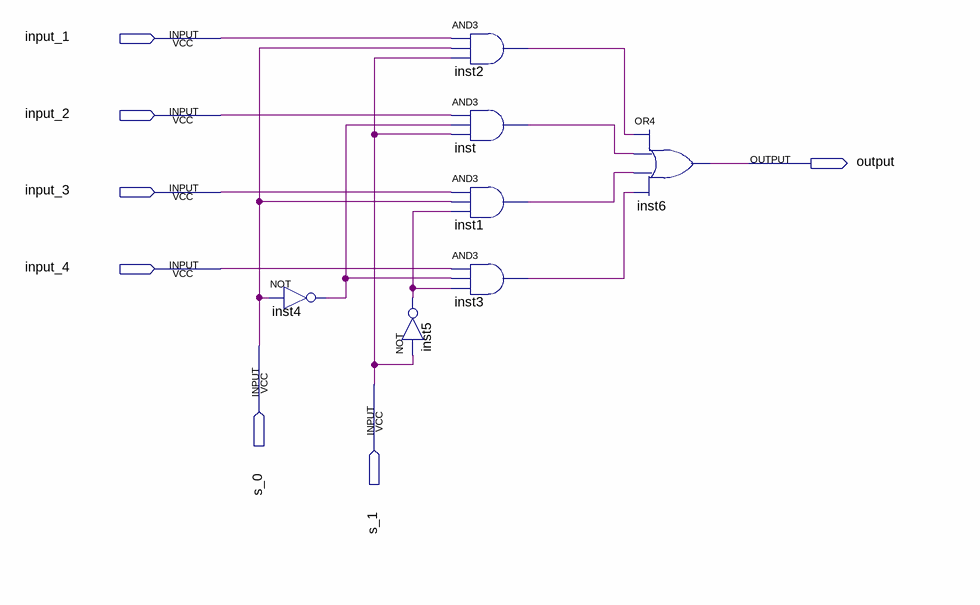
[diagram p0: schematic sheet]
// Quartus schematic Multiplexer.bdf as structural Verilog: 7 symbols, 7 pins
module Multiplexer (
  input  input_1,
  input  input_2,
  input  input_3,
  input  input_4,
  input  s_0,
  input  s_1,
  output \output 
);

  wire inst1_out, inst2_out, inst3_out, inst4_out, inst5_out, inst_out;

  not inst4 (inst4_out, s_0);
  and inst2 (inst2_out, input_1, s_0, s_1);
  and inst (inst_out, input_2, inst4_out, s_1);
  and inst1 (inst1_out, input_3, s_0, inst5_out);
  and inst3 (inst3_out, input_4, inst4_out, inst5_out);
  not inst5 (inst5_out, s_1);
  or inst6 (\output , inst2_out, inst_out, inst1_out, inst3_out);
endmodule
